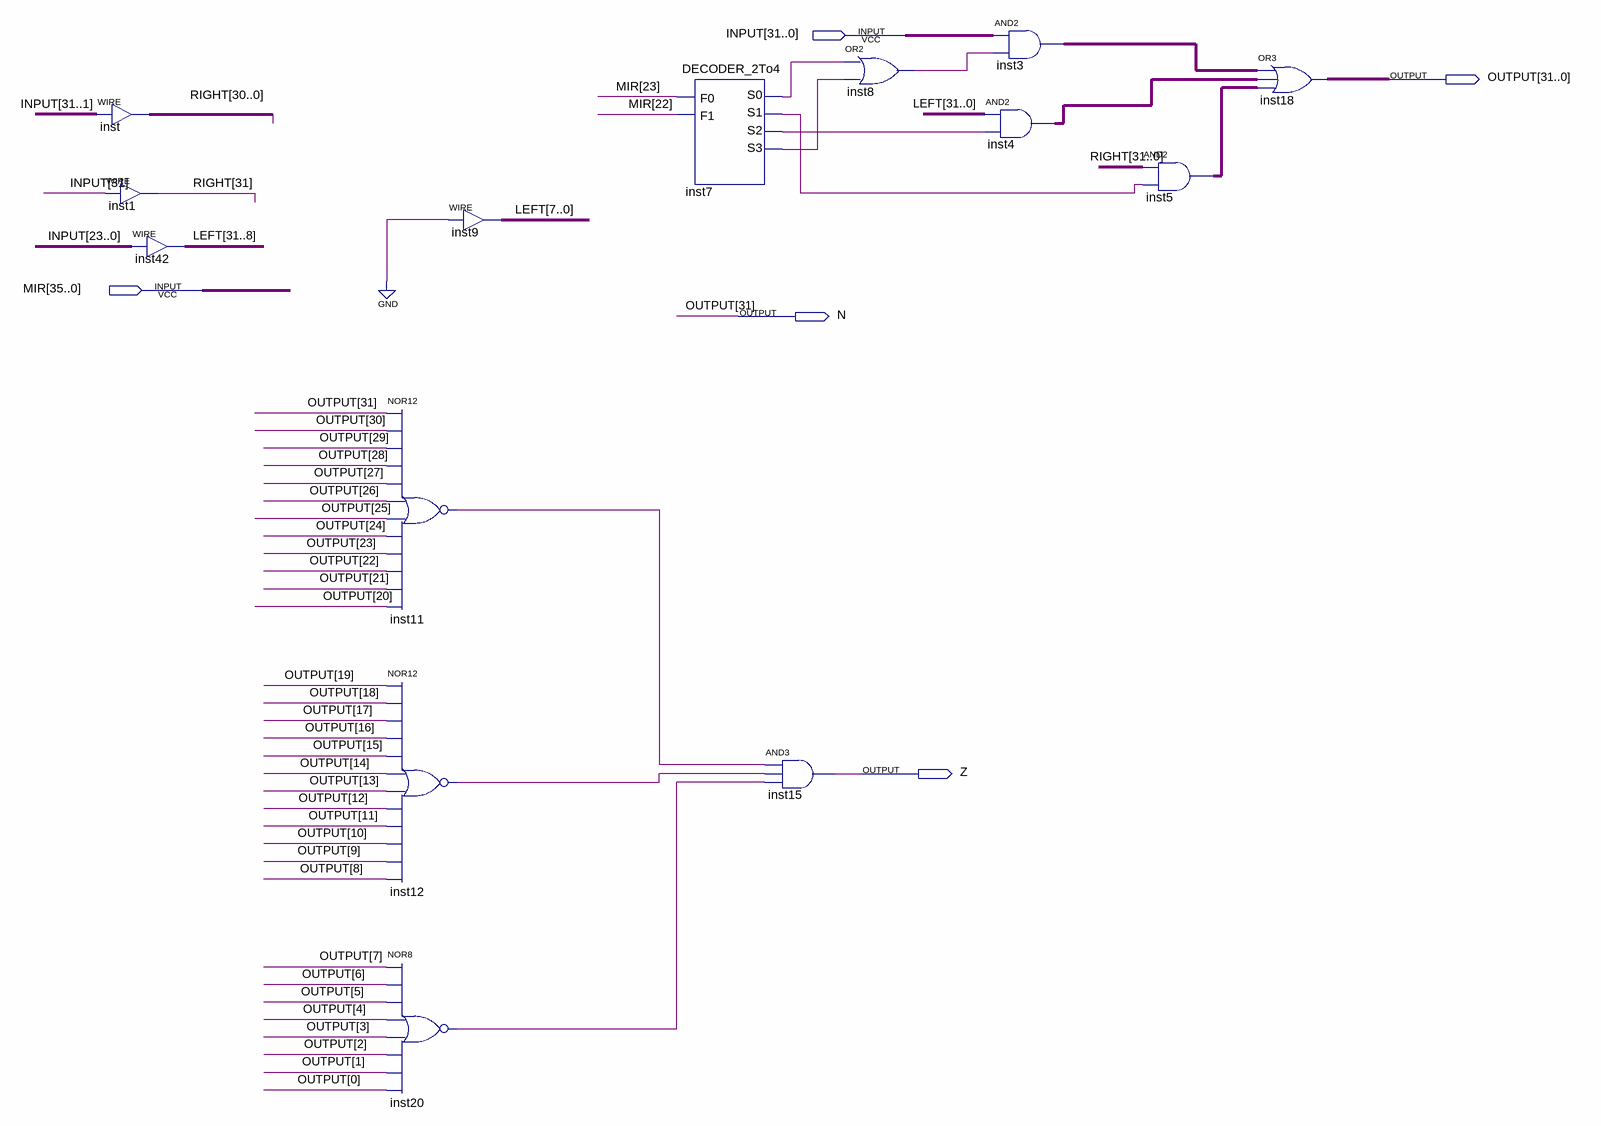
[diagram p0: schematic sheet]
// Quartus schematic SHIFTER.bdf as structural Verilog: 14 symbols, 5 pins
module SHIFTER (
  input  [31:0] INPUT,
  input  [35:0] MIR,
  output [31:0] OUTPUT,
  output N,
  output Z
);

  wire inst7_s0, inst7_s1, inst7_s2, inst7_s3, inst8_out, inst11_out, inst12_out, inst20_out;
  wire [31:0] inst3_out, inst4_out, inst5_out, LEFT, RIGHT;

  assign RIGHT[30:0] = INPUT[31:1];  // WIRE inst
  assign RIGHT[31] = INPUT[31];  // WIRE inst1
  assign LEFT[31:8] = INPUT[23:0];  // WIRE inst42
  nor inst11 (inst11_out, N, OUTPUT[30], OUTPUT[29], OUTPUT[28], OUTPUT[27], OUTPUT[26], OUTPUT[25], OUTPUT[24], OUTPUT[23], OUTPUT[22], OUTPUT[21], OUTPUT[20]);
  nor inst12 (inst12_out, OUTPUT[19], OUTPUT[18], OUTPUT[17], OUTPUT[16], OUTPUT[15], OUTPUT[14], OUTPUT[13], OUTPUT[12], OUTPUT[11], OUTPUT[10], OUTPUT[9], OUTPUT[8]);
  nor inst20 (inst20_out, OUTPUT[7], OUTPUT[6], OUTPUT[5], OUTPUT[4], OUTPUT[3], OUTPUT[2], OUTPUT[1], OUTPUT[0]);
  assign LEFT[7:0] = {8{1'b0}};  // WIRE inst9
  DECODER_2To4 inst7 (.F0(MIR[23]), .F1(MIR[22]), .S3(inst7_s3), .S2(inst7_s2), .S1(inst7_s1), .S0(inst7_s0));
  and inst15 (Z, inst11_out, inst12_out, inst20_out);
  or inst8 (inst8_out, inst7_s3, inst7_s0);
  assign inst3_out = INPUT & {32{inst8_out}};  // AND2 inst3, 32 bits wide
  assign inst4_out = LEFT & {32{inst7_s1}};  // AND2 inst4, 32 bits wide
  assign inst5_out = RIGHT & {32{inst7_s2}};  // AND2 inst5, 32 bits wide
  assign {N, OUTPUT[30:0]} = inst3_out | inst4_out | inst5_out;  // OR3 inst18, 32 bits wide

  assign OUTPUT[31] = N;
endmodule
